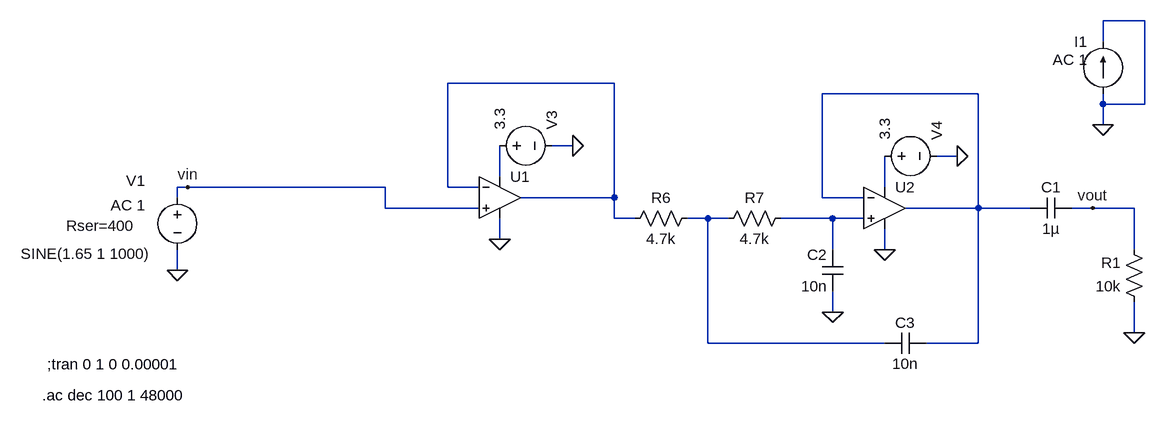
[diagram p0: schematic antialising_output_sallenkey.asc]
antialising_output_sallenkey.asc, the LTspice schematic file:
Version 4
SHEET 1 1128 852
WIRE 224 -448 160 -448
WIRE 160 -416 160 -448
WIRE -592 -352 -848 -352
WIRE -32 -336 -272 -336
WIRE 160 -320 160 -336
WIRE 224 -320 224 -448
WIRE 224 -320 160 -320
WIRE 160 -288 160 -320
WIRE -656 -256 -688 -256
WIRE -64 -240 -96 -240
WIRE -768 -208 -768 -256
WIRE -1248 -192 -1264 -192
WIRE -944 -192 -1248 -192
WIRE -848 -192 -848 -352
WIRE -800 -192 -848 -192
WIRE -176 -192 -176 -240
WIRE -1264 -176 -1264 -192
WIRE -592 -176 -592 -352
WIRE -592 -176 -736 -176
WIRE -272 -176 -272 -336
WIRE -208 -176 -272 -176
WIRE -944 -160 -944 -192
WIRE -800 -160 -944 -160
WIRE -32 -160 -32 -336
WIRE -32 -160 -144 -160
WIRE 48 -160 -32 -160
WIRE 144 -160 112 -160
WIRE 208 -160 144 -160
WIRE -592 -144 -592 -176
WIRE -560 -144 -592 -144
WIRE -448 -144 -480 -144
WIRE -416 -144 -448 -144
WIRE -256 -144 -336 -144
WIRE -208 -144 -256 -144
WIRE -768 -112 -768 -144
WIRE -256 -96 -256 -144
WIRE -176 -96 -176 -128
WIRE 208 -96 208 -160
WIRE -1264 -64 -1264 -96
WIRE -256 0 -256 -32
WIRE 208 32 208 -16
WIRE -448 48 -448 -144
WIRE -176 48 -448 48
WIRE -32 48 -32 -160
WIRE -32 48 -112 48
FLAG -1264 -64 0
FLAG -1248 -192 vin
FLAG -656 -256 0
FLAG -768 -112 0
FLAG -64 -240 0
FLAG -176 -96 0
FLAG 144 -160 vout
FLAG -256 0 0
FLAG 160 -288 0
FLAG 208 32 0
SYMBOL voltage -1264 -192 R0
WINDOW 3 -241 102 Left 2
WINDOW 123 -103 28 Left 2
WINDOW 39 -171 59 Left 2
WINDOW 0 -79 -10 Left 2
SYMATTR Value SINE(1.65 1 1000)
SYMATTR Value2 AC 1
SYMATTR SpiceLine Rser=400
SYMATTR InstName V1
SYMBOL Opamps\\UniversalOpamp2 -768 -176 R0
SYMATTR InstName U1
SYMBOL voltage -784 -256 R270
WINDOW 0 24 96 Left 2
WINDOW 3 24 16 Left 2
WINDOW 123 0 0 Left 0
WINDOW 39 0 0 Left 0
SYMATTR InstName V3
SYMATTR Value 3.3
SYMBOL Opamps\\UniversalOpamp2 -176 -160 R0
SYMATTR InstName U2
SYMBOL voltage -192 -240 R270
WINDOW 0 24 96 Left 2
WINDOW 3 24 16 Left 2
WINDOW 123 0 0 Left 0
WINDOW 39 0 0 Left 0
SYMATTR InstName V4
SYMATTR Value 3.3
SYMBOL res -464 -160 R90
WINDOW 0 0 56 VBottom 2
WINDOW 3 32 56 VTop 2
SYMATTR InstName R6
SYMATTR Value 4.7k
SYMBOL res -320 -160 R90
WINDOW 0 0 56 VBottom 2
WINDOW 3 32 56 VTop 2
SYMATTR InstName R7
SYMATTR Value 4.7k
SYMBOL cap -240 -32 R180
WINDOW 0 24 56 Left 2
WINDOW 3 24 8 Left 2
SYMATTR InstName C2
SYMATTR Value 10n
SYMBOL cap -176 64 R270
WINDOW 0 32 32 VTop 2
WINDOW 3 0 32 VBottom 2
SYMATTR InstName C3
SYMATTR Value 10n
SYMBOL current 160 -336 R180
WINDOW 0 24 80 Left 2
WINDOW 3 24 0 Left 2
WINDOW 123 24 52 Left 2
WINDOW 39 0 0 Left 0
SYMATTR InstName I1
SYMATTR Value ""
SYMATTR Value2 AC 1
SYMBOL cap 48 -144 R270
WINDOW 0 32 32 VTop 2
WINDOW 3 0 32 VBottom 2
SYMATTR InstName C1
SYMATTR Value 1µ
SYMBOL res 224 0 R180
WINDOW 0 36 76 Left 2
WINDOW 3 36 40 Left 2
SYMATTR InstName R1
SYMATTR Value 10k
TEXT -1472 128 Left 2 !.ac dec 100 1 48000
TEXT -1464 80 Left 2 !;tran 0 1 0 0.00001

The netlist it stands for:
* antialising_output_sallenkey.asc
V1 vin 0 SINE(1.65 1 1000) AC 1 Rser=400
XU1 vin N001 N003 0 N001 level.2 Avol=1Meg GBW=10Meg Slew=10Meg ilimit=25m rail=0 Vos=0 phimargin=45 en=0 enk=0 in=0 ink=0 Rin=500Meg  ; pins IN+ IN- V+ V- OUT
V3 N003 0 3.3
XU2 N006 N002 N004 0 N002 level.2 Avol=1Meg GBW=10Meg Slew=10Meg ilimit=25m rail=0 Vos=0 phimargin=45 en=0 enk=0 in=0 ink=0 Rin=500Meg  ; pins IN+ IN- V+ V- OUT
V4 N004 0 3.3
R6 N005 N001 4.7k
R7 N006 N005 4.7k
C2 0 N006 10n
C3 N005 N002 10n
I1 0 0 AC 1
C1 N002 vout 1µ
R1 0 vout 10k
.ac dec 100 1 48000
;tran 0 1 0 0.00001
.lib UniversalOpamps2.sub
.backanno
.end